# EAGLE design Light_Sensor_Layout (EAGLE 6.4)
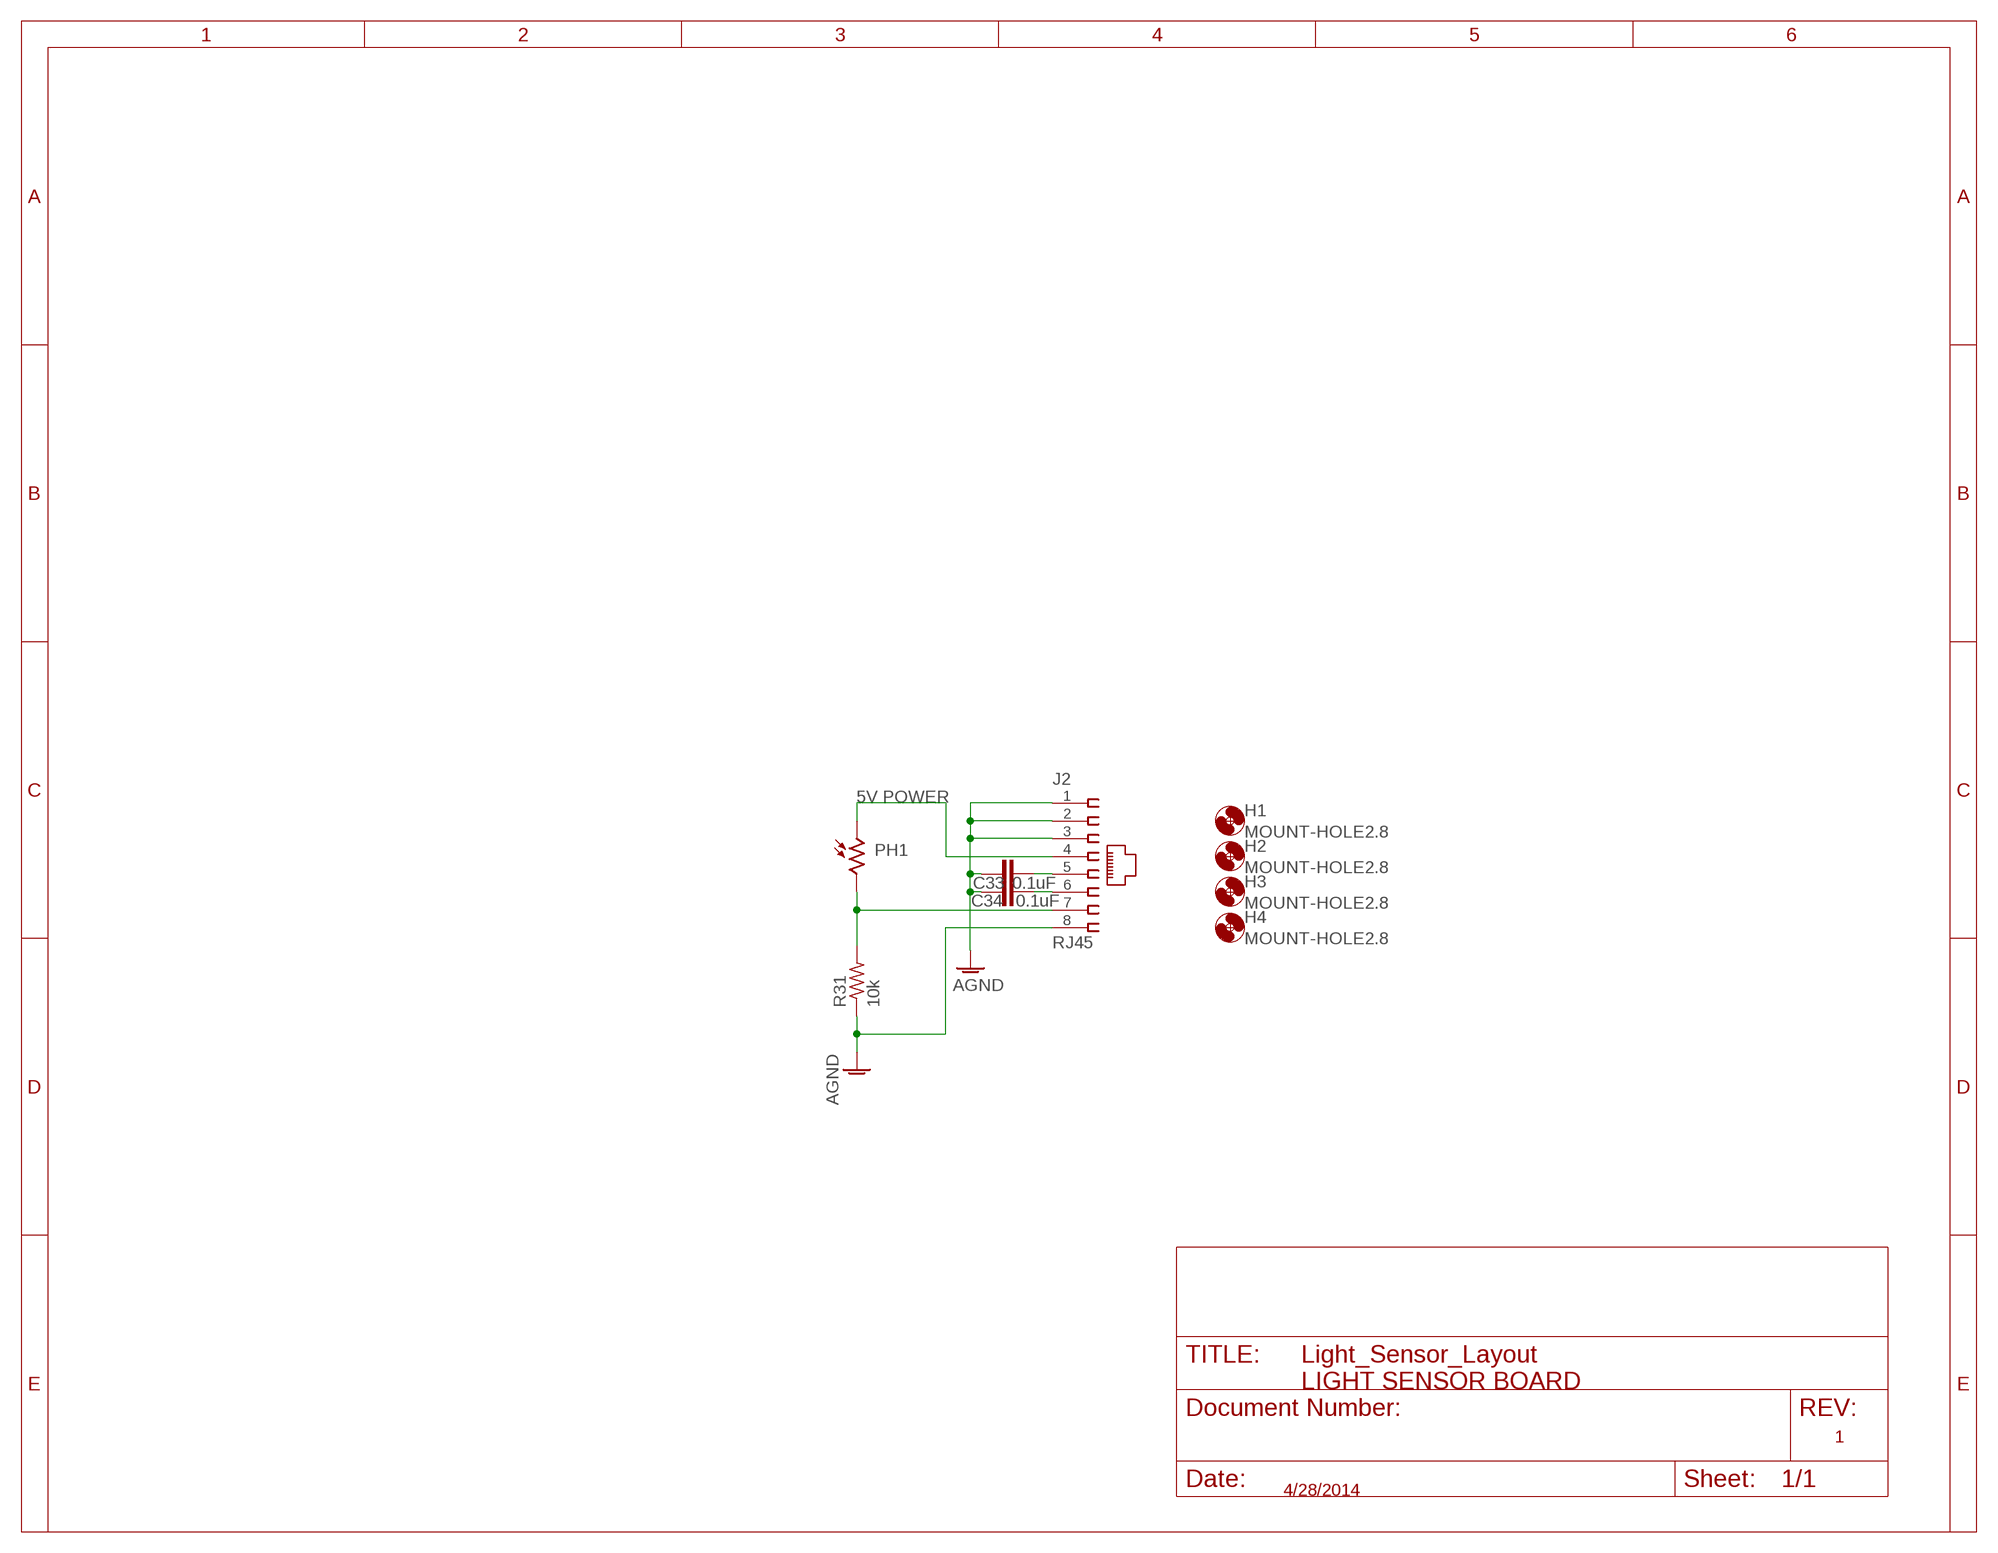
[diagram p0: schematic, sheet 1]

## Parts
C33  0.1uF  C-EUC0603K  [C0603K]
C34  0.1uF  C-EUC0603K  [C0603K]
H1  MOUNT-HOLE2.8  [2,8]
H2  MOUNT-HOLE2.8  [2,8]
H3  MOUNT-HOLE2.8  [2,8]
H4  MOUNT-HOLE2.8  [2,8]
J2  RJ45  555167-1  [555167-1]
PH1  VT90N2  [VT900]
R31  10k  R-US_R1206  [R1206]

## Nets
AGND: C33.1 C34.1 J2.1 J2.2 J2.3 J2.8 R31.1
N$1: J2.4 PH1.1
N$2: J2.7 PH1.2 R31.2
N$23: C33.2 J2.5
N$24: C34.2 J2.6

## Notes on the sheet
- 5V POWER
- LIGHT SENSOR BOARD
- 1
- 4/28/2014

## Library data of the parts
C33 C34 = rcl:C-EU: CAPACITOR, European symbol
H1-H4 = holes:MOUNT-HOLE: MOUNTING HOLE with drill center marker
J2 = con-amp:555167-1: AMP connector
PH1 = photo-elements:VT9: Photoconductive Cell VT900 Series Source: http://optoelectronics.perkinelmer.com/content/Datasheets/DTS_vt900seriesdatasheet.pdf
R31 = rcl:R-US_: RESISTOR, American symbol

## Board
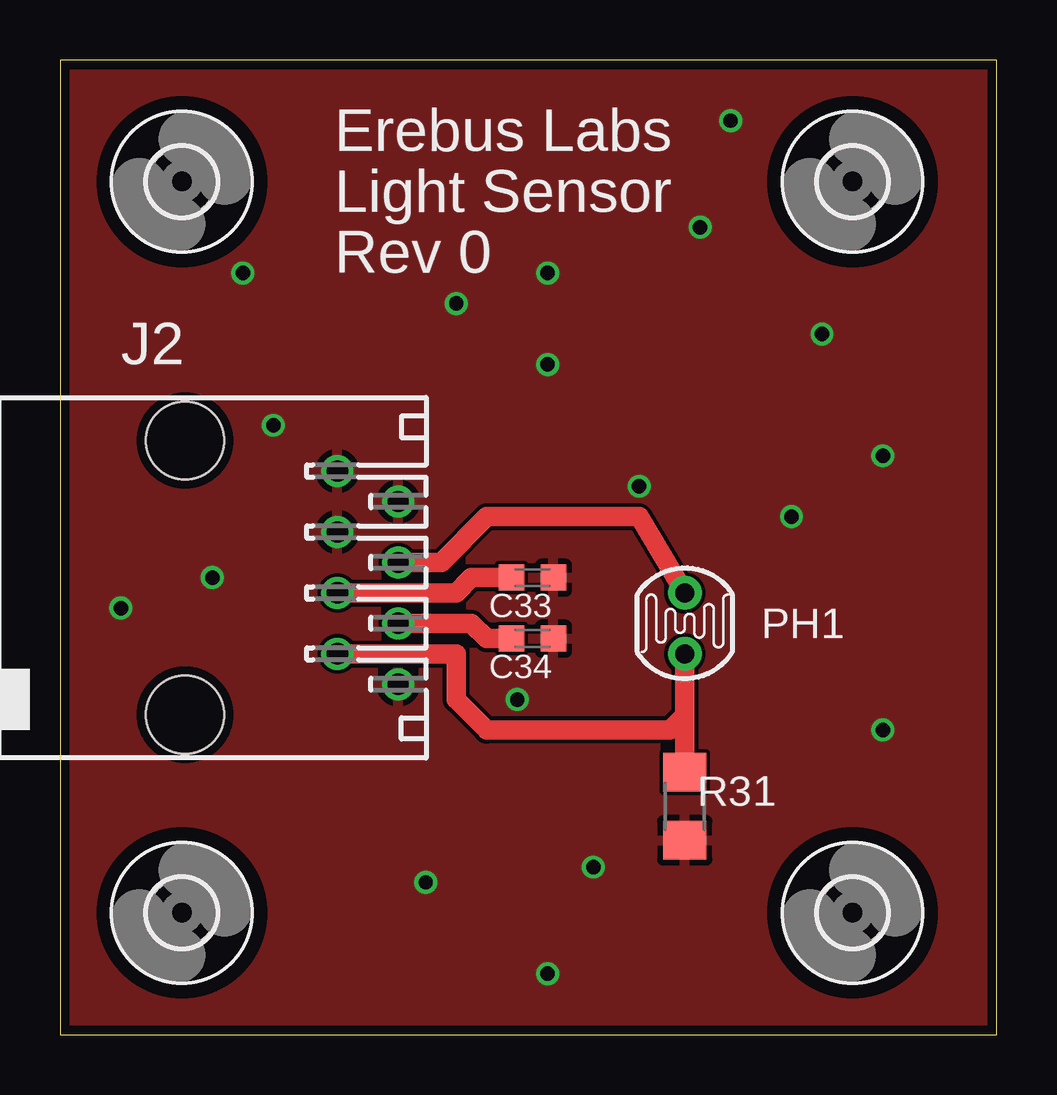
[diagram p1: board, top side]
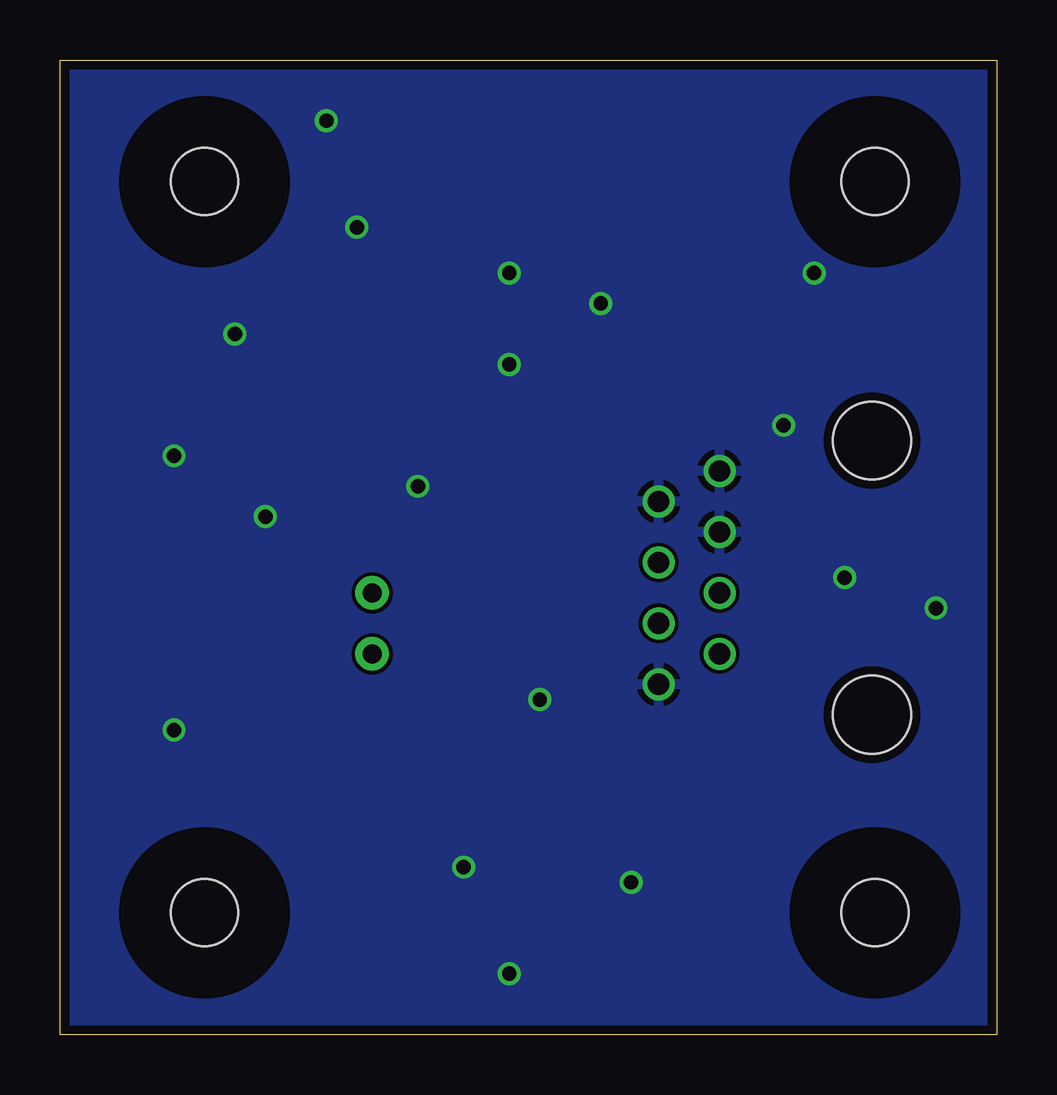
[diagram p2: board, bottom side, seen from below]

Size 39.04 x 40.63 mm. Coordinates in mm from the lower left corner, seen from the top.
Outline: 0,0 39.04,0 39.04,40.63 0,40.63 0,0
Copper layers (1*16): Top 0.0356mm / dielectric 1.5011mm / Bottom 0.0356mm
Design rules "LaenPCBOrder": minimum track width 6mil, minimum drill 13mil, track to track 6mil, track to pad 6mil, pad to pad 6mil, via to via 6mil, smd to smd 6mil, copper to edge 15mil, drill to drill 6mil, minimum pad ring 7mil, minimum via ring 7mil, stop-mask expansion 3mil, vias tented up to drill 0mil, thermal gap 10mil

### Footprints (pad centres in the part's own frame; a part is rotated, then mirrored left to right if it is on the bottom)
C0603K = smd 1.05 x 1.08: 1 -0.875,0; 2 0.875,0
2,8 = hole 2.8: 0,0
555167-1 = drill 0.889: 1 -4.445,5.207; 2 -3.175,7.747; 3 -1.905,5.207; 4 -0.635,7.747; 5 0.635,5.207; 6 1.905,7.747; 7 3.175,5.207; 8 4.445,7.747 | hole 3.251: -5.715,-1.143; 5.715,-1.143
VT900 = drill 0.8 pad 1.4: 1 -1.27,0; 2 1.27,0
R1206 = smd 1.6 x 1.803: 1 -1.422,0; 2 1.422,0

### Placement (x,y rotation side)
C33  19.68,19.05 180 top
C34  19.68,16.51 180 top
H1  5.08,5.08 0 top
H2  33.02,5.08 0 top
H3  33.02,35.56 0 top
H4  5.08,35.56 0 top
J2  6.35,19.05 270 top
PH1  26.04,17.15 270 top
R31  26.04,9.53 90 top

### Tracks (layer width: path | path; a pad name or v marks a point on that pad's centre or on a via)
AGND  (via drill 0.6 pad 0.41)
  other vias: 20.32,2.54 15.24,6.35 22.23,6.98 34.29,12.7 34.29,24.13 30.48,21.59 24.13,22.86 19.05,13.97 31.75,29.21 20.32,27.94 6.35,19.05 2.54,17.78 8.89,25.4 7.62,31.75 16.51,30.48 20.32,31.75 27.94,38.1 26.67,33.66
  pour Bottom: 0,40.64 39.37,40.64 39.37,0 0,0
  pour Top: 0,40.64 39.37,40.64 39.37,0 0,0
N$1
  Top 0.813: J2.4 15.88,19.69 17.78,21.59 24.13,21.59 PH1.1
N$2
  Top 0.813: J2.7 16.51,15.88 16.51,13.97 17.78,12.7 25.4,12.7 26.04,13.34 | PH1.2 26.04,13.34 | 26.04,13.34 R31.2
N$23
  Top 0.813: J2.5 16.51,18.41 17.14,19.05 C33.2
N$24
  Top 0.813: J2.6 17.14,17.15 17.78,16.51 C34.2

### Text on the board
tPlace: Erebus Labs | Light Sensor | Rev 0